# Altium schematic sheet MK-12C02-G015_2022-02-25.schdoc
size 52 x 32 mm
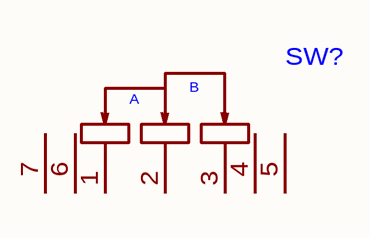
[diagram p0: MK-12C02-G015_2022-02-25.schdoc]

## Parts
SW?  (no value)  [SW-SMD_G-SWITCH_MK-12C02-G015]

## Nets

Not connected (* = marked no-connect by the designer): SW? 1 2 3 4 5 6 7

## Notes on the sheet
- (in symbol MK-12C02-G015) A; B

## Library data of the parts
SW? = MK-12C02-G015